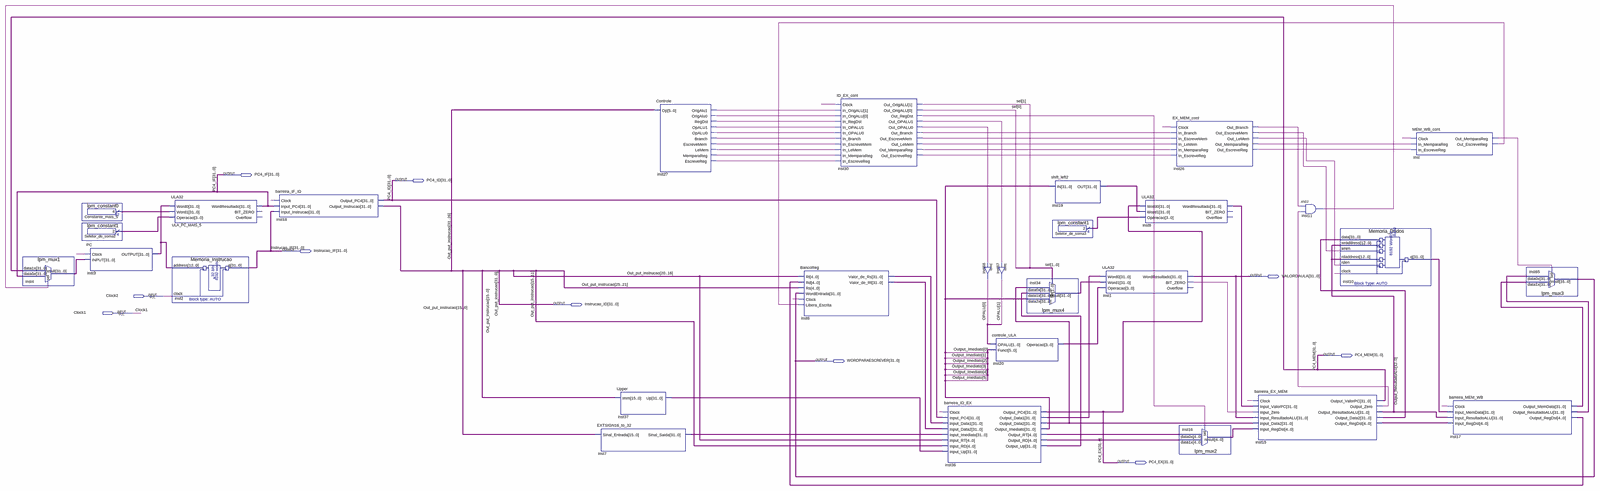
[diagram p0: schematic sheet, whole]
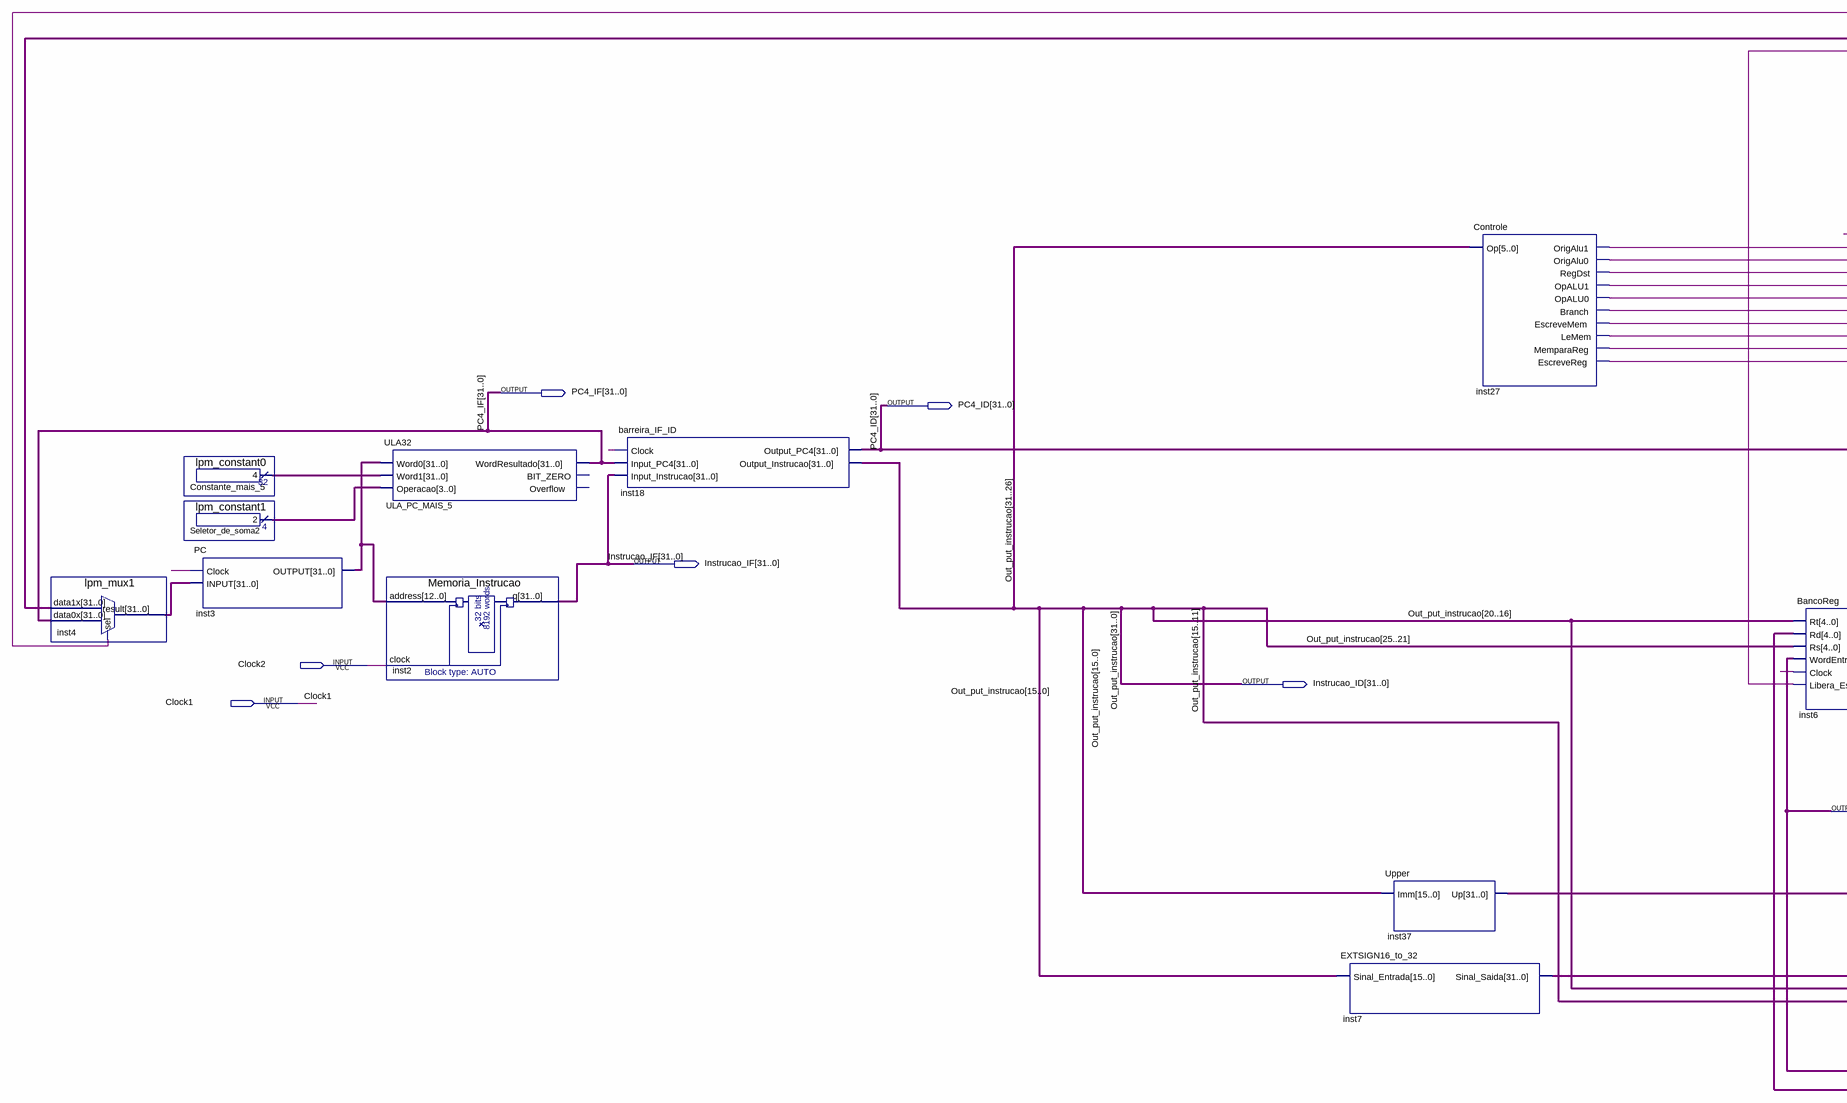
[diagram p1: schematic sheet, left part]
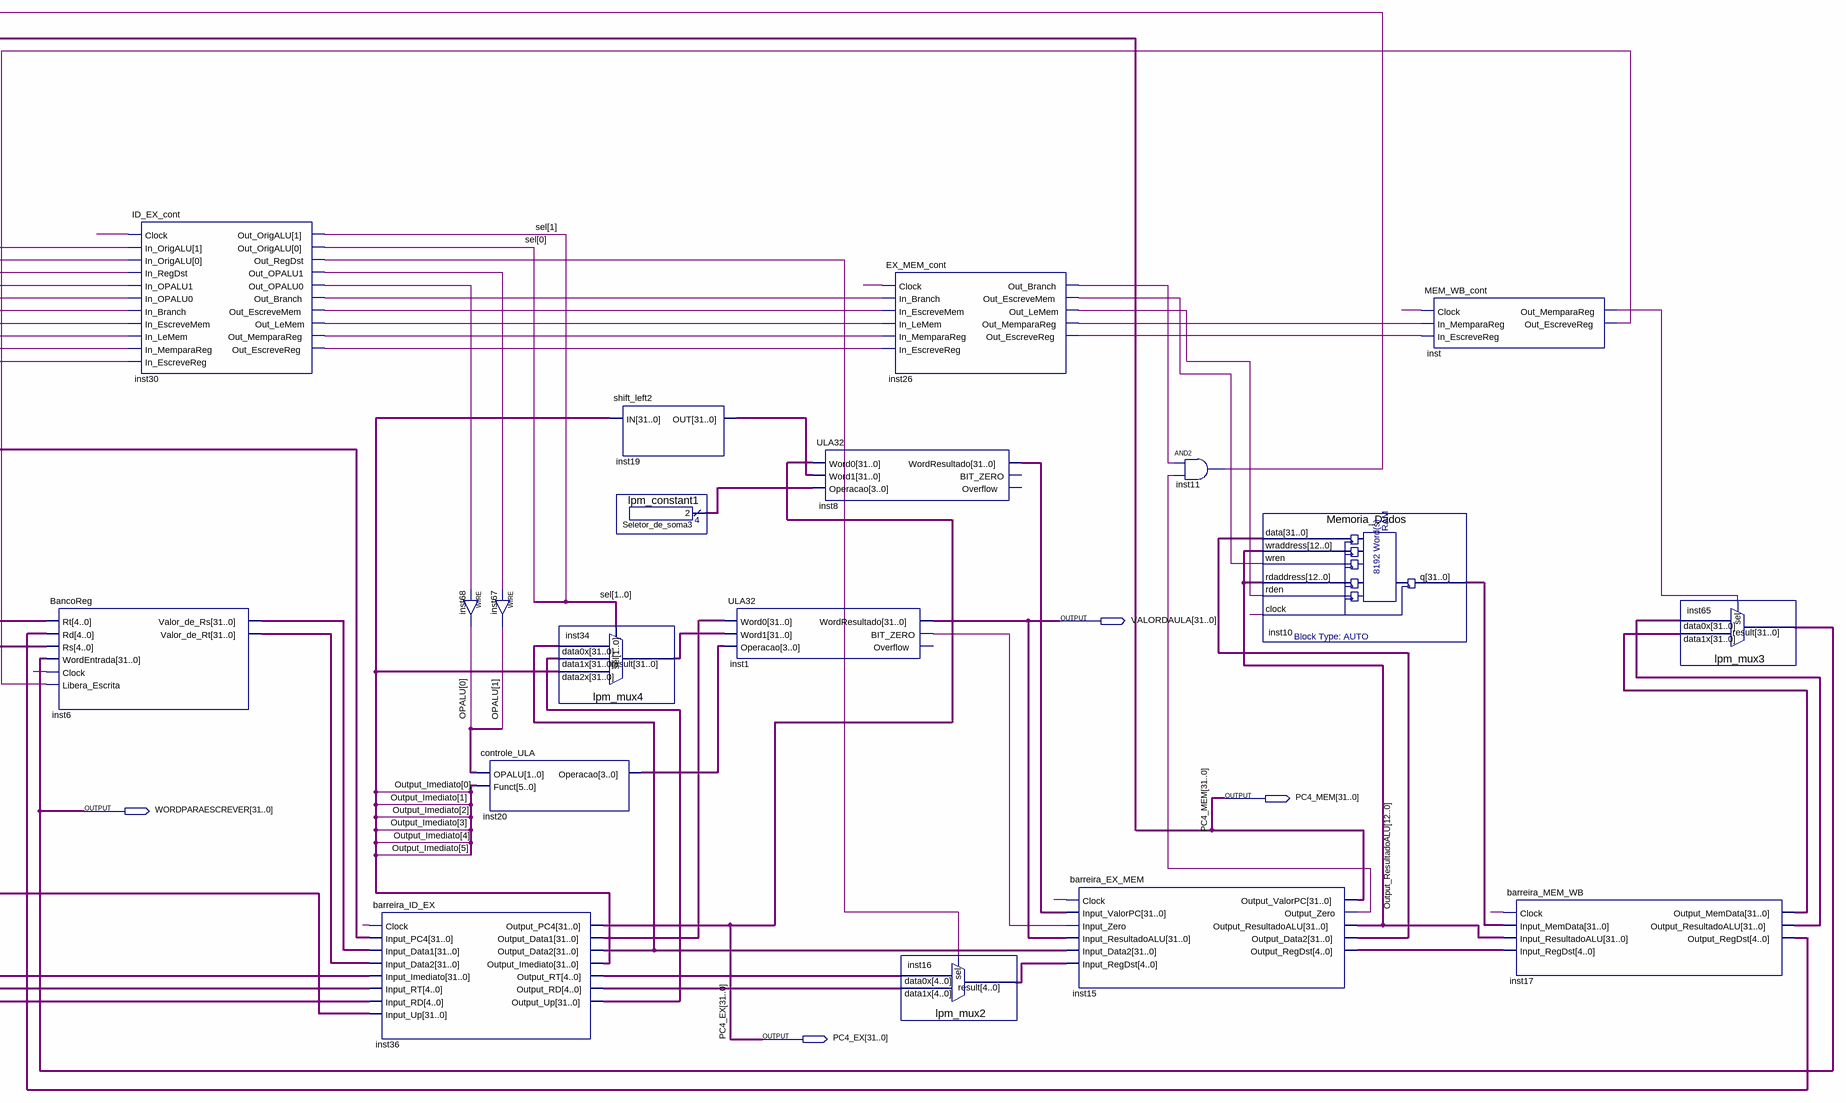
[diagram p2: schematic sheet, right part]
// Quartus schematic Processador.bdf as structural Verilog: 29 symbols, 10 pins
module Processador (
  input  Clock2,
  input  Clock1,
  output [31:0] PC4_IF,
  output [31:0] PC4_ID,
  output [31:0] Instrucao_IF,
  output [31:0] VALORDAULA,
  output [31:0] Instrucao_ID,
  output [31:0] PC4_MEM,
  output [31:0] WORDPARAESCREVER,
  output [31:0] PC4_EX
);

  wire inst1_bit_zero, inst11_out, inst15_output_zero, inst26_out_branch, inst26_out_escrevemem,
       inst26_out_escrevereg, inst26_out_lemem, inst26_out_memparareg, inst27_branch, inst27_escrevemem,
       inst27_escrevereg, inst27_lemem, inst27_memparareg, inst27_opalu0, inst27_opalu1, inst27_origalu0,
       inst27_origalu1, inst27_regdst, inst30_out_branch, inst30_out_escrevemem, inst30_out_escrevereg,
       inst30_out_lemem, inst30_out_memparareg, inst30_out_opalu0, inst30_out_opalu1, inst30_out_regdst,
       inst_out_escrevereg, inst_out_memparareg;
  wire [1:0] OPALU, sel;
  wire [3:0] inst20_operacao, Seletor_de_soma2_result, Seletor_de_soma3_result;
  wire [4:0] inst15_output_regdst, inst16_result, inst17_output_regdst, inst36_output_rd, inst36_output_rt;
  wire [31:0] Constante_mais_5_result, inst4_result, inst6_valor_de_rs, inst6_valor_de_rt, inst7_sinal_saida,
       inst8_wordresultado, inst10_q, inst15_output_data2, inst17_output_memdata, inst17_output_resultadoalu,
       inst19_out, inst34_result, inst36_output_data1, inst36_output_data2, inst36_output_up, inst37_up,
       OUTPUT, Output_Imediato, Output_ResultadoALU;

  lpm_mux1 inst4 (.data1x(PC4_MEM), .data0x(PC4_IF), .sel(inst11_out), .result(inst4_result));
  lpm_constant0 Constante_mais_5 (.result(Constante_mais_5_result));
  lpm_constant1 Seletor_de_soma2 (.result(Seletor_de_soma2_result));
  PC inst3 (.Clock(Clock1), .INPUT(inst4_result), .OUTPUT(OUTPUT));
  ULA32 ULA_PC_MAIS_5 (
    .Word0(OUTPUT), .Word1(Constante_mais_5_result), .Operacao(Seletor_de_soma2_result),
    .WordResultado(PC4_IF));  // open: BIT_ZERO, Overflow
  Memoria_Instrucao inst2 (.address(OUTPUT[12:0]), .clock(Clock2), .q(Instrucao_IF));
  barreira_IF_ID inst18 (
    .Clock(Clock1), .Input_PC4(PC4_IF), .Input_Instrucao(Instrucao_IF), .Output_PC4(PC4_ID),
    .Output_Instrucao(Instrucao_ID));
  EXTSIGN16_to_32 inst7 (.Sinal_Entrada(Instrucao_ID[15:0]), .Sinal_Saida(inst7_sinal_saida));
  Upper inst37 (.Imm(Instrucao_ID[15:0]), .Up(inst37_up));
  Controle inst27 (
    .Op(Instrucao_ID[31:26]), .OrigAlu1(inst27_origalu1), .OrigAlu0(inst27_origalu0), .RegDst(inst27_regdst),
    .OpALU1(inst27_opalu1), .OpALU0(inst27_opalu0), .Branch(inst27_branch), .EscreveMem(inst27_escrevemem),
    .LeMem(inst27_lemem), .MemparaReg(inst27_memparareg), .EscreveReg(inst27_escrevereg));
  BancoReg inst6 (
    .Rt(Instrucao_ID[20:16]), .Rd(inst17_output_regdst), .Rs(Instrucao_ID[25:21]),
    .WordEntrada(WORDPARAESCREVER), .Clock(Clock1), .Libera_Escrita(inst_out_escrevereg),
    .Valor_de_Rs(inst6_valor_de_rs), .Valor_de_Rt(inst6_valor_de_rt));
  ID_EX_cont inst30 (
    .Clock(Clock1), .In_OrigALU({inst27_origalu1, inst27_origalu0}), .In_RegDst(inst27_regdst),
    .In_OPALU1(inst27_opalu1), .In_OPALU0(inst27_opalu0), .In_Branch(inst27_branch),
    .In_EscreveMem(inst27_escrevemem), .In_LeMem(inst27_lemem), .In_MemparaReg(inst27_memparareg),
    .In_EscreveReg(inst27_escrevereg), .Out_OrigALU(sel), .Out_RegDst(inst30_out_regdst),
    .Out_OPALU1(inst30_out_opalu1), .Out_OPALU0(inst30_out_opalu0), .Out_Branch(inst30_out_branch),
    .Out_EscreveMem(inst30_out_escrevemem), .Out_LeMem(inst30_out_lemem),
    .Out_MemparaReg(inst30_out_memparareg), .Out_EscreveReg(inst30_out_escrevereg));
  barreira_ID_EX inst36 (
    .Clock(Clock1), .Input_PC4(PC4_ID), .Input_Data1(inst6_valor_de_rs), .Input_Data2(inst6_valor_de_rt),
    .Input_Imediato(inst7_sinal_saida), .Input_RT(Instrucao_ID[20:16]), .Input_RD(Instrucao_ID[15:11]),
    .Input_Up(inst37_up), .Output_PC4(PC4_EX), .Output_Data1(inst36_output_data1),
    .Output_Data2(inst36_output_data2), .Output_Imediato(Output_Imediato), .Output_RT(inst36_output_rt),
    .Output_RD(inst36_output_rd), .Output_Up(inst36_output_up));
  assign OPALU[0] = inst30_out_opalu0;  // WIRE inst68
  controle_ULA inst20 (.OPALU(OPALU), .Funct(Output_Imediato[5:0]), .Operacao(inst20_operacao));
  assign OPALU[1] = inst30_out_opalu1;  // WIRE inst67
  lpm_mux4 inst34 (
    .data2x(Output_Imediato), .data1x(inst36_output_up), .data0x(inst36_output_data2), .sel(sel),
    .result(inst34_result));
  shift_left2 inst19 (.IN(Output_Imediato), .OUT(inst19_out));
  lpm_constant1 Seletor_de_soma3 (.result(Seletor_de_soma3_result));
  ULA32 inst1 (
    .Word0(inst36_output_data1), .Word1(inst34_result), .Operacao(inst20_operacao),
    .WordResultado(VALORDAULA), .BIT_ZERO(inst1_bit_zero));  // open: Overflow
  ULA32 inst8 (
    .Word0(PC4_EX), .Word1(inst19_out), .Operacao(Seletor_de_soma3_result),
    .WordResultado(inst8_wordresultado));  // open: BIT_ZERO, Overflow
  EX_MEM_cont inst26 (
    .Clock(Clock1), .In_Branch(inst30_out_branch), .In_EscreveMem(inst30_out_escrevemem),
    .In_LeMem(inst30_out_lemem), .In_MemparaReg(inst30_out_memparareg),
    .In_EscreveReg(inst30_out_escrevereg), .Out_Branch(inst26_out_branch),
    .Out_EscreveMem(inst26_out_escrevemem), .Out_LeMem(inst26_out_lemem),
    .Out_MemparaReg(inst26_out_memparareg), .Out_EscreveReg(inst26_out_escrevereg));
  lpm_mux2 inst16 (
    .data1x(inst36_output_rd), .data0x(inst36_output_rt), .sel(inst30_out_regdst), .result(inst16_result));
  barreira_EX_MEM inst15 (
    .Clock(Clock1), .Input_ValorPC(inst8_wordresultado), .Input_Zero(inst1_bit_zero),
    .Input_ResultadoALU(VALORDAULA), .Input_Data2(inst36_output_data2), .Input_RegDst(inst16_result),
    .Output_ValorPC(PC4_MEM), .Output_Zero(inst15_output_zero), .Output_ResultadoALU(Output_ResultadoALU),
    .Output_Data2(inst15_output_data2), .Output_RegDst(inst15_output_regdst));
  and inst11 (inst11_out, inst26_out_branch, inst15_output_zero);
  Memoria_Dados inst10 (
    .data(inst15_output_data2), .wraddress(Output_ResultadoALU[12:0]), .wren(inst26_out_escrevemem),
    .rdaddress(Output_ResultadoALU[12:0]), .rden(inst26_out_lemem), .clock(Clock2), .q(inst10_q));
  MEM_WB_cont inst (
    .Clock(Clock1), .In_MemparaReg(inst26_out_memparareg), .In_EscreveReg(inst26_out_escrevereg),
    .Out_MemparaReg(inst_out_memparareg), .Out_EscreveReg(inst_out_escrevereg));
  barreira_MEM_WB inst17 (
    .Clock(Clock1), .Input_MemData(inst10_q), .Input_ResultadoALU(Output_ResultadoALU),
    .Input_RegDst(inst15_output_regdst), .Output_MemData(inst17_output_memdata),
    .Output_ResultadoALU(inst17_output_resultadoalu), .Output_RegDst(inst17_output_regdst));
  lpm_mux3 inst65 (
    .data1x(inst17_output_memdata), .data0x(inst17_output_resultadoalu), .sel(inst_out_memparareg),
    .result(WORDPARAESCREVER));

  // Other names for the same wires on the sheet: Out_put_instrucao[31:0] = Instrucao_ID
endmodule
